# Altium schematic sheet Connector_WiFi.SchDoc: WiFi board
size B; DocumentNumber: 1; SheetNumber: 1; SheetTotal: 1
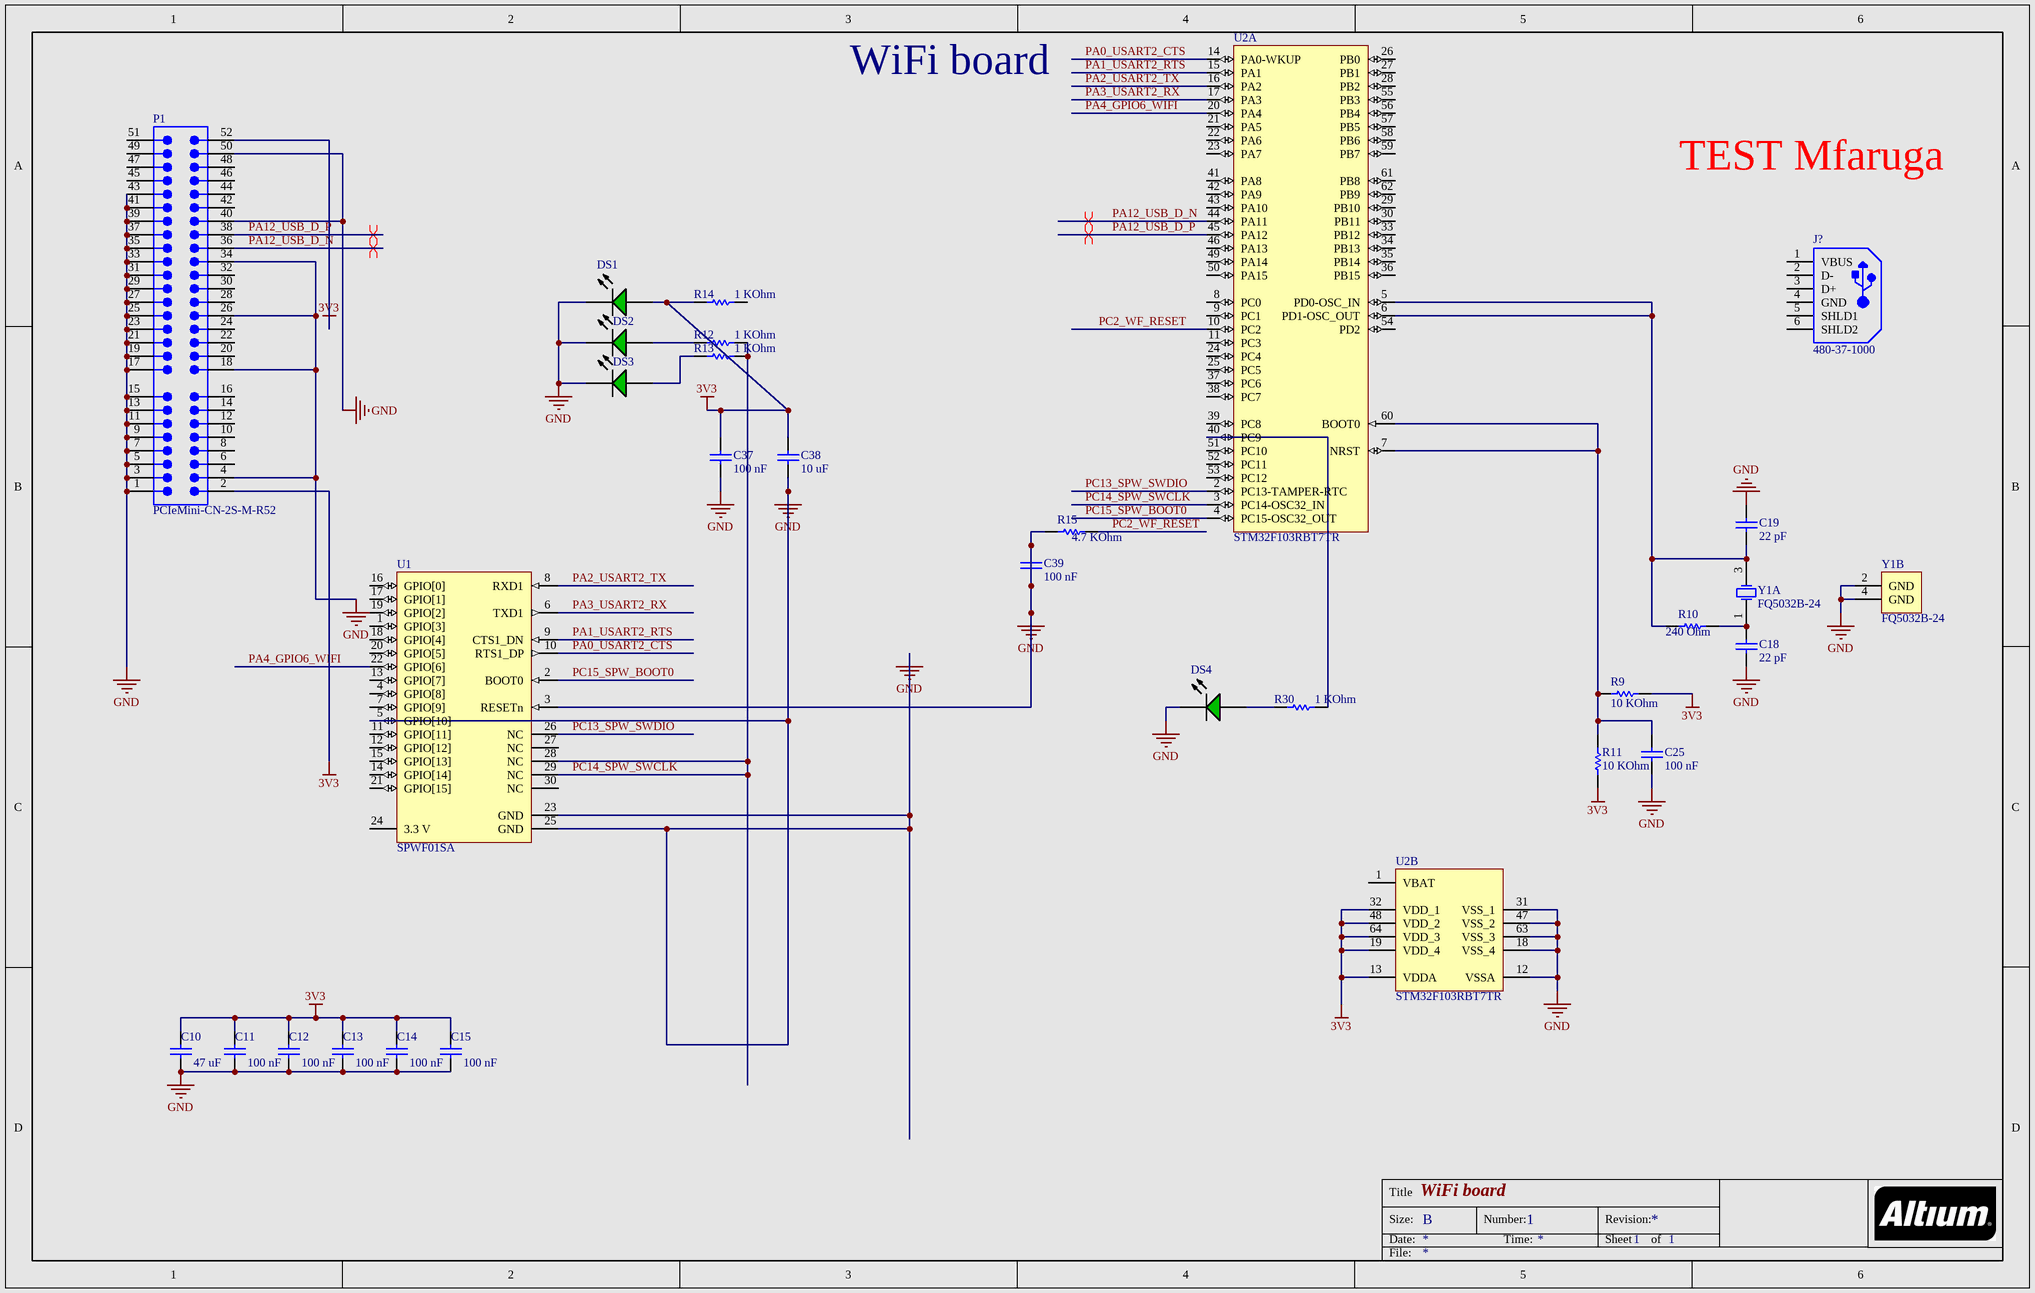
[diagram p0: Connector_WiFi.SchDoc]

## Parts
(Parts that share a designator on the sheet are numbered #1, #2 ... from top to bottom, then left to right.)
C10  Capacitance: 47 uF  [CAPC3216X180X20ML20]  (hidden comment: C3216X5R1A476M160AB)
C11  Capacitance: 100 nF  [CAPC0603X33X15LL03T05]  (hidden comment: GRM033R60J104KE19D)
C12  Capacitance: 100 nF  [CAPC0603X33X15LL03T05]  (hidden comment: GRM033R60J104KE19D)
C13  Capacitance: 100 nF  [CAPC0603X33X15LL03T05]  (hidden comment: GRM033R60J104KE19D)
C14  Capacitance: 100 nF  [CAPC0603X33X15LL03T05]  (hidden comment: GRM033R60J104KE19D)
C15  Capacitance: 100 nF  [CAPC0603X33X15LL03T05]  (hidden comment: GRM033R60J104KE19D)
C18  Capacitance: 22 pF  [CAPC1005X55X10LL05]  (hidden comment: C1005C0G1H220J050BA)
C19  Capacitance: 22 pF  [CAPC1005X55X10LL05]  (hidden comment: C1005C0G1H220J050BA)
C25  Capacitance: 100 nF  [CAPC0603X33X15LL03T05]  (hidden comment: GRM033R60J104KE19D)
C37  Capacitance: 100 nF  [CAPC0603X33X15LL03T05]  (hidden comment: GRM033R60J104KE19D)
C38  Capacitance: 10 uF  [CAPC2013X100X20NL20]  (hidden comment: C2012X5R1C106K085AC)
C39  Capacitance: 100 nF  [CAPC0603X33X15LL03T05]  (hidden comment: GRM033R60J104KE19D)
DS1  150060VS75000  [WE-150060VS75000_V]  (value not drawn)
DS2  150060VS75000  [WE-150060VS75000_V]  (value not drawn)
DS3  150060VS75000  [WE-150060VS75000_V]  (value not drawn)
DS4  150060VS75000  [WE-150060VS75000_V]  (value not drawn)
J?  480-37-1000  [MOLX-480-37-1000_V]
P1  PCIeMini-CN-2S-M-R52  [PCIeMini-GF-2D-800-1K-S52]  (no BOM)
R9  Resistance: 10 KOhm  [RESC1005X40X25NL05T05]  (hidden comment: ERJ-2RKF1002X)
R10  Resistance: 240 Ohm  [RESC1005X40X25ML05T05]  (hidden comment: ERJ-2GEJ241x)
R11  Resistance: 10 KOhm  [RESC1005X40X25NL05T05]  (hidden comment: ERJ-2RKF1002X)
R12  Resistance: 1 KOhm  [RESC1005X40X25NL05T05]  (hidden comment: ERJ-2RKF1001X)
R13  Resistance: 1 KOhm  [RESC1005X40X25NL05T05]  (hidden comment: ERJ-2RKF1001X)
R14  Resistance: 1 KOhm  [RESC1005X40X25NL05T05]  (hidden comment: ERJ-2RKF1001X)
R15  Resistance: 4.7 KOhm  [RESC1005X40X25LL05T05]  (hidden comment: ERJ-2RKF4701X)
R30  Resistance: 1 KOhm  [RESC1005X40X25NL05T05]  (hidden comment: ERJ-2RKF1001X)
U1  SPWF01SA  [STM-SPWF01SA_V]
U2  STM32F103RBT7TR  [STM-LQFP64_L]  (parts A,B of 2)
Y1#1  FQ5032B-24  [FOX-FQ5032B_V]  (part B of 2)
Y1#2  FQ5032B-24  [FOX-FQ5032B_V]  (part A of 2)

## Nets
3V3: C10.2 C11.2 C12.2 C13.2 C14.2 C15.2 C37.2 C38.2 DS1.2(A) P1.2 P1.52 R9.1 R11.1 R14.1 U2.13(VDDA) U2.19(VDD_4) U2.32(VDD_1) U2.48(VDD_2) U2.64(VDD_3)
GND: C10.1 C11.1 C12.1 C13.1 C14.1 C15.1 C18.1 C19.2 C25.1 C37.1 C38.1 C39.1 C39.2 DS1.1(K) DS2.1(K) DS3.1(K) DS4.1(K) P1.1 P1.3 P1.4 P1.5 P1.7 P1.9 P1.11 P1.13 P1.15 P1.17 P1.18 P1.19 P1.21 P1.23 P1.25 P1.26 P1.27 P1.29 P1.31 P1.33 P1.34 P1.35 P1.37 P1.39 P1.40 P1.41 P1.43 P1.50 R15.1 U1.3(RESETn) U1.5(GPIO[10]) U1.23(GND) U1.25(GND) U2.12(VSSA) U2.18(VSS_4) U2.31(VSS_1) U2.47(VSS_2) U2.63(VSS_3) Y1#1.2(GND) Y1#1.4(GND)
PA0_USART2_CTS: U1.10(RTS1_DP) U2.14(PA0-WKUP)
PA1_USART2_RTS: U1.9(CTS1_DN) U2.15(PA1)
PA2_USART2_TX: U1.8(RXD1) U2.16(PA2)
PA3_USART2_RX: U1.6(TXD1) U2.17(PA3)
PA4_GPIO6_WIFI: U1.22(GPIO[6]) U2.20(PA4)
PA12_USB_D_N: P1.36 U2.44(PA11)
PA12_USB_D_P: P1.38 U2.45(PA12)
PC2_WF_RESET: R15.2 U2.10(PC2)
PC13_SPW_SWDIO: U1.26(NC) U2.2(PC13-TAMPER-RTC)
PC14_SPW_SWCLK: R12.2 R13.2 U1.28(NC) U1.29(NC) U2.3(PC14-OSC32_IN)
PC15_SPW_BOOT0: U1.2(BOOT0) U2.4(PC15-OSC32_OUT)
NetC18_2: C18.2 R10.2 Y1#2.1(X1)
NetC19_1: C19.1 R10.1 U2.5(PD0-OSC_IN) U2.6(PD1-OSC_OUT) Y1#2.3(X2)
NetC25_2: C25.2 R9.2 R11.2 U2.7(NRST) U2.60(BOOT0)
NetDS2_2: DS2.2(A) R12.1
NetDS3_2: DS3.2(A) R13.1
NetDS4_2: DS4.2(A) R30.1
NetR30_2: R30.2 U2.40(PC9)

Not connected (* = marked no-connect by the designer): J? 1(VBUS) 2(D-) 3(D+) 4(GND) 5(SHLD1) 6(SHLD2); P1 6 8 10 12 14 16 20 22 24 28 30 32 42 44 45 46 47 48 49 51; R14 2; U1 1(GPIO[3]) 4(GPIO[8]) 7(GPIO[9]) 11(GPIO[11]) 12(GPIO[12]) 13(GPIO[7]) 14(GPIO[14]) 15(GPIO[13]) 16(GPIO[0]) 17(GPIO[1]) 18(GPIO[4]) 19(GPIO[2]) 20(GPIO[5]) 21(GPIO[15]) 24(3.3_V) 27(NC) 30(NC); U2 1(VBAT) 8(PC0) 9(PC1) 11(PC3) 21(PA5) 22(PA6) 23(PA7) 24(PC4) 25(PC5) 26(PB0) 27(PB1) 28(PB2) 29(PB10) 30(PB11) 33(PB12) 34(PB13) 35(PB14) 36(PB15) 37(PC6) 38(PC7) 39(PC8) 41(PA8) 42(PA9) 43(PA10) 46(PA13) 49(PA14) 50(PA15) 51(PC10) 52(PC11) 53(PC12) 54(PD2) 55(PB3) 56(PB4) 57(PB5) 58(PB6) 59(PB7) 61(PB8) 62(PB9)

## Layout directives
differential pair: PA12_USB_D_N, PA12_USB_D_P

## Notes on the sheet
- TEST Mfaruga
- Title
- Size:
- Date:
- B
- Number:
- Time:
- Revision:
- Sheet
- of
- File:

## Library data of the parts
C10 = CMP-1663-00005-1: Chip Capacitor, 47 uF, +/- 20%, 10 V, -55 to 85 degC, 1206 (3216 Metric), RoHS, Tape and Reel; Voltage Rating (DC): 10 V; Type (Capacitors): X5R; Case\/Package: 1206; Tolerance: 20%; Voltage Rating: 10 V; Packaging: Tape and Reel; ComponentLink2URL: https://product.tdk.com/info/en/catalog/datasheets/mlcc_commercial_general_en.pdf; Min Operating Temperature: -55 degC; Length: 3.2 mm; Radiation Hardening: No; Mounting Technology: Surface Mount; PackageDescription: 2-Pin Surface Mount Device, Body 3.2 x 1.6 mm; Max Operating Temperature: 85 degC; Case Code (Metric): 3216; ComponentLink1URL: http://www.tdk.com/; DatasheetVersion: 03/2015; Mount: Surface Mount; Case Code (Imperial): 1206; Package Quantity: 2000; ComponentLink2Description: Datasheet; PackageReference: 3216; Height: 1.6 mm; RoHSCompliant: true; Width: 1.6 mm; ComponentLink1Description: Manufacturer URL
C11-C15 C25 C37 C39 = CMP-2010-01652-4: Chip Capacitor, 100 nF, +/- 10%, 6.3 V, -55 to 85 degC, 0201 (0603 Metric), RoHS, Tape and Reel; Manufacturer: Basic Passives; Type (Capacitors): X5R; Voltage Rating: 6.3 V; Voltage Rating (DC): 3 V; Case\/Package: 0201; ComponentLink1URL: http://www.murata.com/; Max Operating Temperature: 85 degC; Packaging: Tape and Reel; REACH SVHC: No SVHC; Length: 0.6 mm; Width: 0.3 mm; ComponentLink2Description: Datasheet; Pins: 2; Tolerance: 10%; Case Code (Metric): 0603; Height: 0.3 mm; Mounting Technology: Surface Mount; PackageReference: 0201; Min Operating Temperature: -55 degC; Case Code (Imperial): 0201; ComponentLink1Description: Manufacturer URL; Mount: Surface Mount; Package Quantity: 15000; ComponentLink2URL: http://search.murata.co.jp/Ceramy/image/img/A01X/G101/ENG/GRM033R60J104KE19-01.pdf; RoHSCompliant: true; DatasheetVersion: 03/2016; Radiation Hardening: No; PartNumber: GRM033R60J104KE19D; PackageDescription: 2-Pin Surface Mount Device, Body 0.6 x 0.3 mm
C18 C19 = CMP-1663-00008-2: Chip Capacitor, 22 pF, +/- 5%, 50 V, -55 to 125 degC, 0402 (1005 Metric), RoHS, Tape and Reel; Case\/Package: 0402; Type (Capacitors): C0G; Voltage Rating: 50 V; PackageReference: 0402; ComponentLink1Description: Manufacturer URL; Mount: Surface Mount; RoHSCompliant: true; Tolerance: 5%; Pins: 2; Packaging: Tape and Reel; ComponentLink2Description: Datasheet; Mounting Technology: Surface Mount; Height: 0.5 mm; PartNumber: C1005C0G1H220J050BA; Max Operating Temperature: 125 degC; Width: 0.5 mm; PackageDescription: 2-Pin Surface Mount Device, Body 1 x 0.5 mm; ComponentLink2URL: https://product.tdk.com/info/en/catalog/datasheets/mlcc_commercial_general_en.pdf; Case Code (Metric): 1005; ComponentLink1URL: http://www.tdk.com/; Case Code (Imperial): 0402; Package Quantity: 10000; Radiation Hardening: No; Length: 1 mm; DatasheetVersion: 08/2016; Voltage Rating (DC): 50 V; REACH SVHC: No SVHC; Min Operating Temperature: -55 degC
C38 = CMP-1663-00007-1: Chip Capacitor, 10 uF, +/- 10%, 16 V, -55 to 85 degC, 0805 (2012 Metric), RoHS, Tape and Reel; Type (Capacitors): X5R; Voltage Rating (DC): 16 V; Case\/Package: 0805; Mounting Technology: Surface Mount; Min Operating Temperature: -55 degC; Length: 2 mm; Case Code (Metric): 2012; PackageReference: 0805; Voltage Rating: 16 V; RoHSCompliant: true; ComponentLink1Description: Manufacturer URL; Width: 1.25 mm; ComponentLink1URL: http://www.tdk.com/; Max Operating Temperature: 85 degC; REACH SVHC: No SVHC; Mount: Surface Mount; Tolerance: 10%; ComponentLink2URL: https://product.tdk.com/info/en/catalog/datasheets/mlcc_commercial_general_en.pdf; ComponentLink2Description: Datasheet; Pins: 2; Packaging: Tape and Reel; Height: 0.85 mm; Package Quantity: 1; DatasheetVersion: 03/2015; Case Code (Imperial): 0805; PackageDescription: 2-Pin Surface Mount Device, Body 2 x 1.25 mm
DS1-DS4 = CMP-1712-00001-3: WL-SMCW SMD Chip LED Top View Monocolor Waterclear, 30 mA, 2 V, -40 to 85 degC, 2-Pin SMD, RoHS, Tape and Reel; DatasheetVersion: Rev. 2.7; PackageDescription: 2-Pin Surface Mount Device, Body 1.6 x 0.8 mm; ComponentLink1URL: https://www.we-online.com/; PartNumber: 150060VS75000; RoHSCompliant: True; ComponentLink2URL: http://katalog.we-online.de/led/datasheet/150060VS75000.pdf; ComponentLink1Description: Manufacturer URL; Mounting Technology: Surface Mount; ComponentLink2Description: Datasheet
J? = CMP-002-00040-1: Universal Serial Bus (USB) Shielded I/O Plug, Type A, Right Angle Connector, 4 Position, Height 4.6 mm, -20 to 85 degC, RoHS, Tray; Manufacturer: Molex; Max Voltage Rating (AC): 150V; Max Current Rating: 1.5A; Gender: Male; Datasheet Version: Rev. D, 06/2004; Pins: 4; Package Description: 4-Pin Surface Mount Device, Body 12 x 18.8 mm; Contact Material: Brass; Case/Package: 480-37-1000; Connector Type: USB; Datasheet URL: http://www.molex.com/pdm_docs/sd/480371000_sd.pdf; Manufacturer URL: http://www.molex.com/; Contact Plating: Gold; Max Operating Temperature: 85°C; Packaging: Tray; Current Rating: 1.5A; Package Reference: 480-37-1000; Colour: Black; Min Operating Temperature: -20°C; RoHS Compliant: True; Mounting Technology: SM; Voltage Rating (AC): 150V
P1 = CMP-0001-00067-2: Golden finger, PCIeMini, Dual, Staggered, Pitch 0.8mm, 52-Position; Mating Connector: Tyco-292443-1; Package Version: rev1.2, Oct-2007; System: Connector; Package Reference: PCIeMini-GF-2D-800-1K-S52; Datasheet Version: Revision 1.2 Oct-2007; ClassName: Edge Connector; Publisher: Altium
R9 R11 = CMP-2002-00607-3: Chip Resistor, 10 KOhm, +/- 1%, 100 mW, -55 to 155 degC, 0402 (1005 Metric), RoHS, Tape and Reel; Manufacturer: Basic Passives; Case\/Package: 0402; Voltage Rating: 50 V; Power Rating: 100 mW; Packaging: Tape and Reel; Width: 0.5 mm; Package Quantity: 10000; Radiation Hardening: No; Min Operating Temperature: -55 degC; Case Code (Imperial): 0402; REACH SVHC: Yes; PackageDescription: 2-Pin Surface Mount Device, Body 1 x 0.5 mm; Length: 1 mm; ComponentLink1Description: Manufacturer URL; PackageReference: 0402; RoHSCompliant: true; ComponentLink1URL: http://www.panasonic.com/; Height: 0.35 mm; ComponentLink2Description: Datasheet; DatasheetVersion: 04/2015; Mounting Technology: Surface Mount; ComponentLink2URL: http://industrial.panasonic.com/cdbs/www-data/pdf/RDA0000/AOA0000C86.pdf; Max Operating Temperature: 155 degC; Pins: 2; Tolerance: 1%; PartNumber: ERJ-2RKF1002X; Case Code (Metric): 1005; Mount: Surface Mount
R10 = CMP-2002-00493-3: Chip Resistor, 240 Ohm, +/- 5%, 100 mW, -55 to 155 degC, 0402 (1005 Metric), RoHS, Tape and Reel; Manufacturer: Basic Passives; Voltage Rating: 50 V; Case\/Package: 0402; Power Rating: 100 mW; PackageReference: 0402; ComponentLink1URL: http://www.panasonic.com/; ComponentLink2Description: Datasheet; PackageDescription: 2-Pin Surface Mount Device, Body 1 x 0.5 mm; Tolerance: 5%; Radiation Hardening: No; Packaging: Tape and Reel; Case Code (Metric): 1005; PartNumber: ERJ-2GEJ241x; Case Code (Imperial): 0402; Mount: Surface Mount; REACH SVHC: Yes; Length: 1 mm; Mounting Technology: Surface Mount; Max Operating Temperature: 155 degC; Height: 0.35 mm; Width: 0.5 mm; Package Quantity: 10000; RoHSCompliant: true; DatasheetVersion: 03/2015; Pins: 2; ComponentLink1Description: Manufacturer URL; Min Operating Temperature: -55 degC; ComponentLink2URL: http://industrial.panasonic.com/cdbs/www-data/pdf/RDA0000/AOA0000C84.pdf
R12-R14 R30 = CMP-2002-00606-3: Chip Resistor, 1 KOhm, +/- 1%, 100 mW, -55 to 155 degC, 0402 (1005 Metric), RoHS, Tape and Reel; Manufacturer: Basic Passives; Voltage Rating: 50 V; Case\/Package: 0402; Power Rating: 100 mW; PartNumber: ERJ-2RKF1001X; DatasheetVersion: 04/2015; Radiation Hardening: No; Pins: 2; Height: 0.35 mm; RoHSCompliant: true; Case Code (Imperial): 0402; ComponentLink2Description: Datasheet; ComponentLink1Description: Manufacturer URL; PackageReference: 0402; Mount: Surface Mount; Package Quantity: 10000; Tolerance: 1%; ComponentLink1URL: http://www.panasonic.com/; PackageDescription: 2-Pin Surface Mount Device, Body 1 x 0.5 mm; Mounting Technology: Surface Mount; Case Code (Metric): 1005; ComponentLink2URL: http://industrial.panasonic.com/cdbs/www-data/pdf/RDA0000/AOA0000C86.pdf; REACH SVHC: Yes; Packaging: Tape and Reel; Max Operating Temperature: 155 degC; Min Operating Temperature: -55 degC; Width: 0.5 mm; Length: 1 mm
R15 = CMP-1665-00031-3: Chip Resistor, 4.7 KOhm, +/- 1%, 0.1 W, -55 to 155 degC, 0402 (1005 Metric), RoHS, Tape and Reel; Voltage Rating: 50 V; Case\/Package: 0402; Power Rating: 100 mW; Height: 0.35 mm; Mounting Technology: Surface Mount; REACH SVHC: Yes; Max Operating Temperature: 155 degC; ComponentLink1Description: Manufacturer URL; ComponentLink2Description: Datasheet; Pins: 2; PackageReference: 0402; Tolerance: 1%; Case Code (Imperial): 0402; Length: 1 mm; PackageDescription: 2-Pin Surface Mount Device, Body 1 x 0.5 mm; PartNumber: ERJ-2RKF4701X; RoHSCompliant: true; Package Quantity: 1; Radiation Hardening: No; DatasheetVersion: 04/2015; Width: 0.5 mm; Case Code (Metric): 1005; Mount: Surface Mount; ComponentLink1URL: http://www.panasonic.com/; Min Operating Temperature: -55 degC; Packaging: Cut Tape; ComponentLink2URL: http://industrial.panasonic.com/cdbs/www-data/pdf/RDA0000/AOA0000C86.pdf
U1 = CMP-1771-00005-1: Serial to WiFi Server IEEE802.11b/g/n Intelligent Module, 3.3 V, - 40 to 85 degC, 30-Pin SMD, RoHS, Tray; ComponentLink1URL: http://www.st.com/; PackageReference: SPWF01SA; DatasheetVersion: Rev. 1; ComponentLink1Description: Manufacturer URL; PackageDescription: 30-Pin Surface Mount Device, Body 26.924 x 15.24 mm, Pitch 1.524 mm, Height 2.45 mm; Mounting Technology: Surface Mount
U2 = CMP-0237-00158-3: ARM Cortex-M3 32-bit MCU, 128 KB Flash, 20 KB Internal RAM, 51 I/Os, 64-pin LQFP, -40 to 105 degC, Tape and Reel; Internal RAM Size (kB): 20; Operating Frequency(F) (Processor speed) (MHz): 72; A/D Converter: 2x12-bit (16 Channel); Supply Voltage(Vcc) min (V): 2; I/Os (High Current): 51; FLASH Size (Prog) (kB): 128; ComponentLink3URL: http://www.st.com/st-web-ui/static/active/en/resource/technical/document/datasheet/DM00037051.pdf; PackageVersion: Rev. 4, 06/2013; ComponentLink1URL: http://www.st.com/web/en/home.html; DatasheetVersion: Rev. 16; Packing: Tape and Reel; PackageDescription: 64-Pin Low Profile Quad Flat Package, 10 x 10 mm Body, 0.5 mm Pitch; ComponentLink3Description: Package Specification; PartNumber: STM32F103RBT7TR; Mounting Technology: Surface Mount; PackageReference: LQFP64; ComponentLink2URL: http://www.st.com/st-web-ui/static/active/en/resource/technical/document/datasheet/CD00161566.pdf; ComponentLink2Description: Datasheet; Core: ARM Cortex-M3; ComponentLink1Description: Manufacturer URL; PartId: 1
Y1#1 Y1#2 = CMP-0399-00003-1: Crystal Oscillator, SMD, 24MHz, Stab=30ppm 20.0pF; Manufacturer: FOX Electronics; Frequency Tolerance: 30 ppm; Mounting Technology: Surface Mount; Nominal Frequency: 24 MHz; ComponentLink2Description: Datasheet; ComponentLink1Description: Manufacturer URL; ComponentLink2URL: http://www.foxonline.com/pdfs/fq5032.pdf; PackageDescription: 4-Pin SMT Crystal, 5.2 x 3.4 mm Body; DatasheetVersion: Mar-10; ComponentLink1URL: http://www.foxonline.com/; PartNumber: FQ5032B-24; Storage Temperature: -40 to 85 degC; PackageReference: FQ5032B
  Y1#1: PartId: 2